# EasyEDA Pro project ProProject_STM32F103ZET6_OV7670FIFO_TFT_2024-07-11.epro

# Schematic Schematic1
Create Date: 2024-05-30; Page Name: P1; Project Name: STM32F103ZET6_OV7670FIFO_TFT; Schematic Name: Schematic1; Update Date: 2024-06-04; Company: 嘉立创EDA; Page Size: A4; Version: V1.0
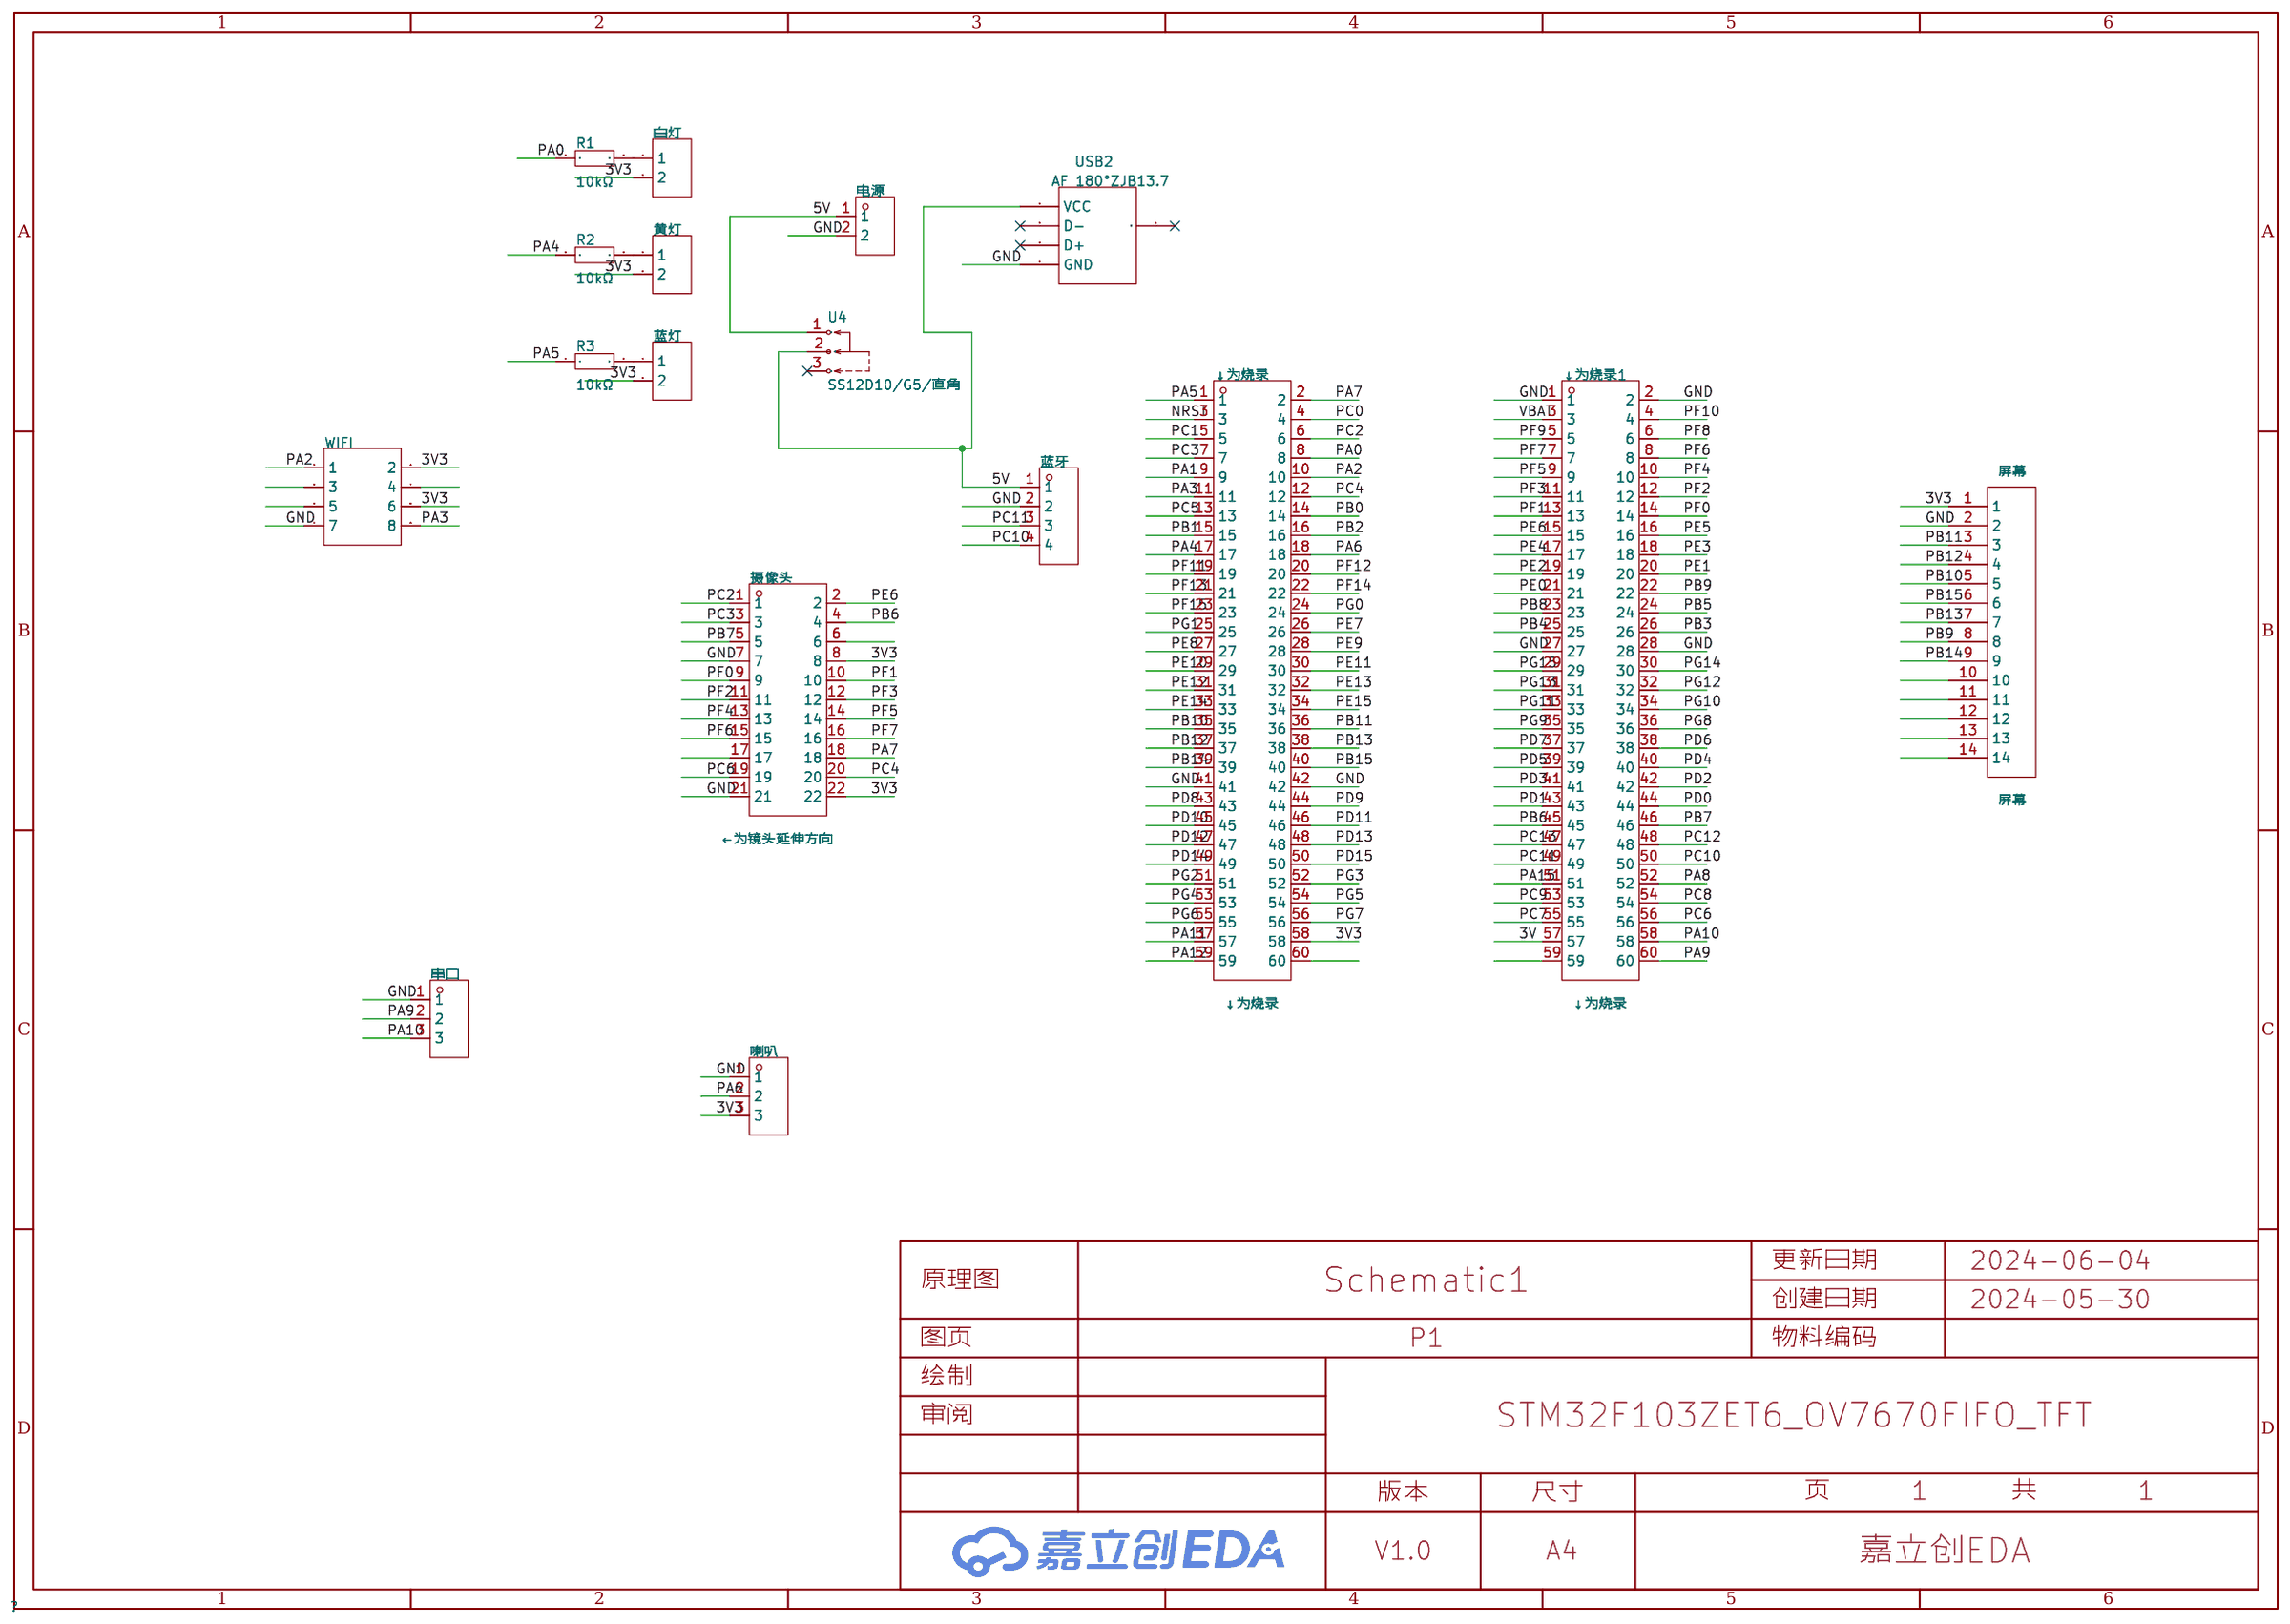
[diagram p0: schematic sheet]

## Parts
R1  10kΩ  [Res_1/8W]
R2  10kΩ  [Res_1/8W]
R3  10kΩ  [Res_1/8W]
U4  SS12D10/G5/直角  [SW-TH_SHOU-HAN_SS12D10G4]
USB2  AF 180°ZJB13.7  [USB-A-TH_AF-ZJB13.7]
WIFI  -  [HDR-TH_8P-P2.54-V-F-R2-C4-S2.54-1]
↓为烧录  ↓为烧录  [HDR-TH_60P-P2.54-H-M-R2-C30-S2.54-N]
↓为烧录1  ↓为烧录  [HDR-TH_60P-P2.54-H-M-R2-C30-S2.54-N]
串口  -  [HDR-TH_3P-P2.54-V-M]
喇叭  -  [HDR-TH_3P-P2.54-V-F]
屏幕  屏幕  [HDR-TH_14P-P2.54-V-F-1]
摄像头  ←为镜头延伸方向  [HDR-TH_22P-P2.54-H-M-R2-C11-S2.54]
电源  MX126-5.0-GN01-02P-CU-S-A  [CONN-TH_2P-P5.00_MX126-5.0-GN01-02P-CU-S-A]
白灯  -  [HDR-TH_2P-P2.54-V-F]
蓝灯  -  [HDR-TH_2P-P2.54-V-F]
蓝牙  -  [HDR-TH_4P-P2.54-V-F]
黄灯  -  [HDR-TH_2P-P2.54-V-F]

## Library data of the parts
R1-R3 = Res_AXIAL-1/8W: Supplier Footprint: 轴向引线
U4 = SS12D10/G5/直角: Supplier Part: C9900029541; Supplier Footprint: THrough hole; JLCPCB Part Class: 扩展库; Supplier: LCSC
USB2 = AF 180°ZJB13.7: link: https://item.szlcsc.com/458822.html; Supplier: LCSC; Supplier Part: C456015; Manufacturer: SHOU HAN(首韩); JLCPCB Part Class: Extended Part
WIFI = HDR-F_2.54_2x4: Supplier Part: C92271; Supplier Footprint: 插件
↓为烧录 ↓为烧录1 = X6521WR-2x30H-C60D30: 插针结构:2x30P;间距:2.54mm;行距:2.54mm;圆针/方针:方针;安装类型:-;排数:双排;总PIN位数:60P;额定电流:3A;额定电压:250V;配合针长度:6mm;塑高:2.5mm;端接针长度:3mm;触头材质:黄铜;触头镀层:金;工作温度范围:-40℃~+105℃;焊接温度(最大值):260℃;颜色:黑色;; LCSC Part Name: 2x30P 间距:2.54mm 方针; Supplier Part: C2883974; Manufacturer: XKB Connection(中国星坤); Supplier Footprint: 弯插,P=2.54mm; JLCPCB Part Class: 扩展库; Supplier: LCSC; Pin Structure: 2x30P; Pitch: 2.54mm; Row Spacing: 2.54mm; Circluar Pins/Square Pins: 方针; Number of Rows: 双排; Number of Pins: 60P; Current Rating (Max): 3A; Voltage Rating (Max): 250V; Length of Mating Pin: 6mm; Insulation Height: 2.5mm; Length of End Connection Pin: 3mm; Contact Material: 黄铜; Contact Plating: 金; Operating Temperature Range: -40℃~+105℃; Soldering Temperature(Max): 260℃; Color: 黑色
串口 = HDR-M_2.54_1x3P: Supplier Part: C2937625; Supplier Footprint: 插件
喇叭 = HDR-F_2.54_1x3P: Supplier Part: C541850; Supplier Footprint: 插件
屏幕 = HDR-F-2.54_1x14P: Supplier Part: C52711; Supplier Footprint: 插件
摄像头 = X6521WR-2x11H-C60D30: 插针结构:2x11P;间距:2.54mm;行距:2.54mm;圆针/方针:方针;安装类型:-;排数:双排;总PIN位数:22P;额定电流:3A;额定电压:250V;配合针长度:6mm;塑高:2.5mm;端接针长度:3mm;触头材质:黄铜;触头镀层:金;工作温度范围:-40℃~+105℃;焊接温度(最大值):260℃;颜色:黑色;; LCSC Part Name: 2x11P 间距:2.54mm 方针; Supplier Part: C725923; Manufacturer: XKB Connection(中国星坤); Supplier Footprint: 弯插,P=2.54mm; JLCPCB Part Class: 扩展库; Supplier: LCSC; Pin Structure: 2x11P; Pitch: 2.54mm; Row Spacing: 2.54mm; Circluar Pins/Square Pins: 方针; Number of Rows: 双排; Number of Pins: 22P; Current Rating (Max): 3A; Voltage Rating (Max): 250V; Length of Mating Pin: 6mm; Insulation Height: 2.5mm; Length of End Connection Pin: 3mm; Contact Material: 黄铜; Contact Plating: 金; Operating Temperature Range: -40℃~+105℃; Soldering Temperature(Max): 260℃; Color: 黑色
电源 = MX126-5.0-GN01-02P-CU-S-A: link: https://atta.szlcsc.com/upload/public/pdf/source/20221024/69A8295958E0DAFC8E5B6F48112698FA.pdf; Supplier: LCSC; Supplier Part: C5188434; Manufacturer: MAX(迈旭); Manufacturer Part: MX126-5.0-02P-GN01-Cu-S-A; JLCPCB Part Class: Extended Part
白灯 蓝灯 黄灯 = HDR-F_2.54_1x2P: Supplier Part: C49661; Supplier Footprint: 插件
蓝牙 = HDR-F_2.54_1x4P: Supplier Part: C2718488; Supplier Footprint: 插件

## Nets
3V: ↓为烧录1.57
3V3: WIFI.2 WIFI.6 ↓为烧录.58 喇叭.3 屏幕.1 摄像头.8 摄像头.22 白灯.2 蓝灯.2 黄灯.2
5V: U4.1 U4.2 USB2.1(VCC) ↓为烧录.60 ↓为烧录1.59 电源.1 蓝牙.1
GND: USB2.4(GND) WIFI.7 ↓为烧录.41 ↓为烧录.42 ↓为烧录1.1 ↓为烧录1.2 ↓为烧录1.27 ↓为烧录1.28 串口.1 喇叭.1 屏幕.2 摄像头.7 摄像头.21 电源.2 蓝牙.2
VBAT: ↓为烧录1.3
NRST: ↓为烧录.3
PA0: R1.1 ↓为烧录.8
PA1: ↓为烧录.9
PA2: WIFI.1 ↓为烧录.10
PA3: WIFI.8 ↓为烧录.11
PA4: R2.1 ↓为烧录.17
PA5: R3.1 ↓为烧录.1
PA6: ↓为烧录.18 喇叭.2
PA7: ↓为烧录.2 摄像头.18
PA8: ↓为烧录1.52
PA9: ↓为烧录1.60 串口.2
PA10: ↓为烧录1.58 串口.3
PA11: ↓为烧录.57
PA12: ↓为烧录.59
PA15: ↓为烧录1.51
PB0: ↓为烧录.14
PB1: ↓为烧录.15
PB2: ↓为烧录.16
PB3: ↓为烧录1.26
PB4: ↓为烧录1.25
PB5: ↓为烧录1.24
PB6: ↓为烧录1.45 摄像头.4
PB7: ↓为烧录1.46 摄像头.5
PB8: ↓为烧录1.23
PB9: ↓为烧录1.22 屏幕.8
PB10: ↓为烧录.35 屏幕.5
PB11: ↓为烧录.36 屏幕.3
PB12: ↓为烧录.37 屏幕.4
PB13: ↓为烧录.38 屏幕.7
PB14: ↓为烧录.39 屏幕.9
PB15: ↓为烧录.40 屏幕.6
PC0: ↓为烧录.4
PC1: ↓为烧录.5
PC2: ↓为烧录.6 摄像头.1
PC3: ↓为烧录.7 摄像头.3
PC4: ↓为烧录.12 摄像头.20
PC5: ↓为烧录.13
PC6: ↓为烧录1.56 摄像头.19
PC7: ↓为烧录1.55
PC8: ↓为烧录1.54
PC9: ↓为烧录1.53
PC10: ↓为烧录1.50 蓝牙.4
PC11: ↓为烧录1.49 蓝牙.3
PC12: ↓为烧录1.48
PC13: ↓为烧录1.47
PD0: ↓为烧录1.44
PD1: ↓为烧录1.43
PD2: ↓为烧录1.42
PD3: ↓为烧录1.41
PD4: ↓为烧录1.40
PD5: ↓为烧录1.39
PD6: ↓为烧录1.38
PD7: ↓为烧录1.37
PD8: ↓为烧录.43
PD9: ↓为烧录.44
PD10: ↓为烧录.45
PD11: ↓为烧录.46
PD12: ↓为烧录.47
PD13: ↓为烧录.48
PD14: ↓为烧录.49
PD15: ↓为烧录.50
PE0: ↓为烧录1.21
PE1: ↓为烧录1.20
PE2: ↓为烧录1.19
PE3: ↓为烧录1.18
PE4: ↓为烧录1.17
PE5: ↓为烧录1.16
PE6: ↓为烧录1.15 摄像头.2
PE7: ↓为烧录.26
PE8: ↓为烧录.27
PE9: ↓为烧录.28
PE10: ↓为烧录.29
PE11: ↓为烧录.30
PE12: ↓为烧录.31
PE13: ↓为烧录.32
PE14: ↓为烧录.33
PE15: ↓为烧录.34
PF0: ↓为烧录1.14 摄像头.9
PF1: ↓为烧录1.13 摄像头.10
PF2: ↓为烧录1.12 摄像头.11
PF3: ↓为烧录1.11 摄像头.12
PF4: ↓为烧录1.10 摄像头.13
PF5: ↓为烧录1.9 摄像头.14
PF6: ↓为烧录1.8 摄像头.15
PF7: ↓为烧录1.7 摄像头.16
PF8: ↓为烧录1.6
PF9: ↓为烧录1.5
PF10: ↓为烧录1.4
PF11: ↓为烧录.19
PF12: ↓为烧录.20
PF13: ↓为烧录.21
PF14: ↓为烧录.22
PF15: ↓为烧录.23
PG0: ↓为烧录.24
PG1: ↓为烧录.25
PG2: ↓为烧录.51
PG3: ↓为烧录.52
PG4: ↓为烧录.53
PG5: ↓为烧录.54
PG6: ↓为烧录.55
PG7: ↓为烧录.56
PG8: ↓为烧录1.36
PG9: ↓为烧录1.35
PG10: ↓为烧录1.34
PG11: ↓为烧录1.33
PG12: ↓为烧录1.32
PG13: ↓为烧录1.31
PG14: ↓为烧录1.30
PG15: ↓为烧录1.29
$1N3460: R1.2 白灯.1
$1N3486: R2.2 黄灯.1
$1N3512: R3.2 蓝灯.1

Not connected (* = marked no-connect by the designer): U4 3*; USB2 2(D-)* 3(D+)* 5(SHLD)*; WIFI 3 4 5; 屏幕 10 11 12 13 14; 摄像头 6 17

# Board PCB1
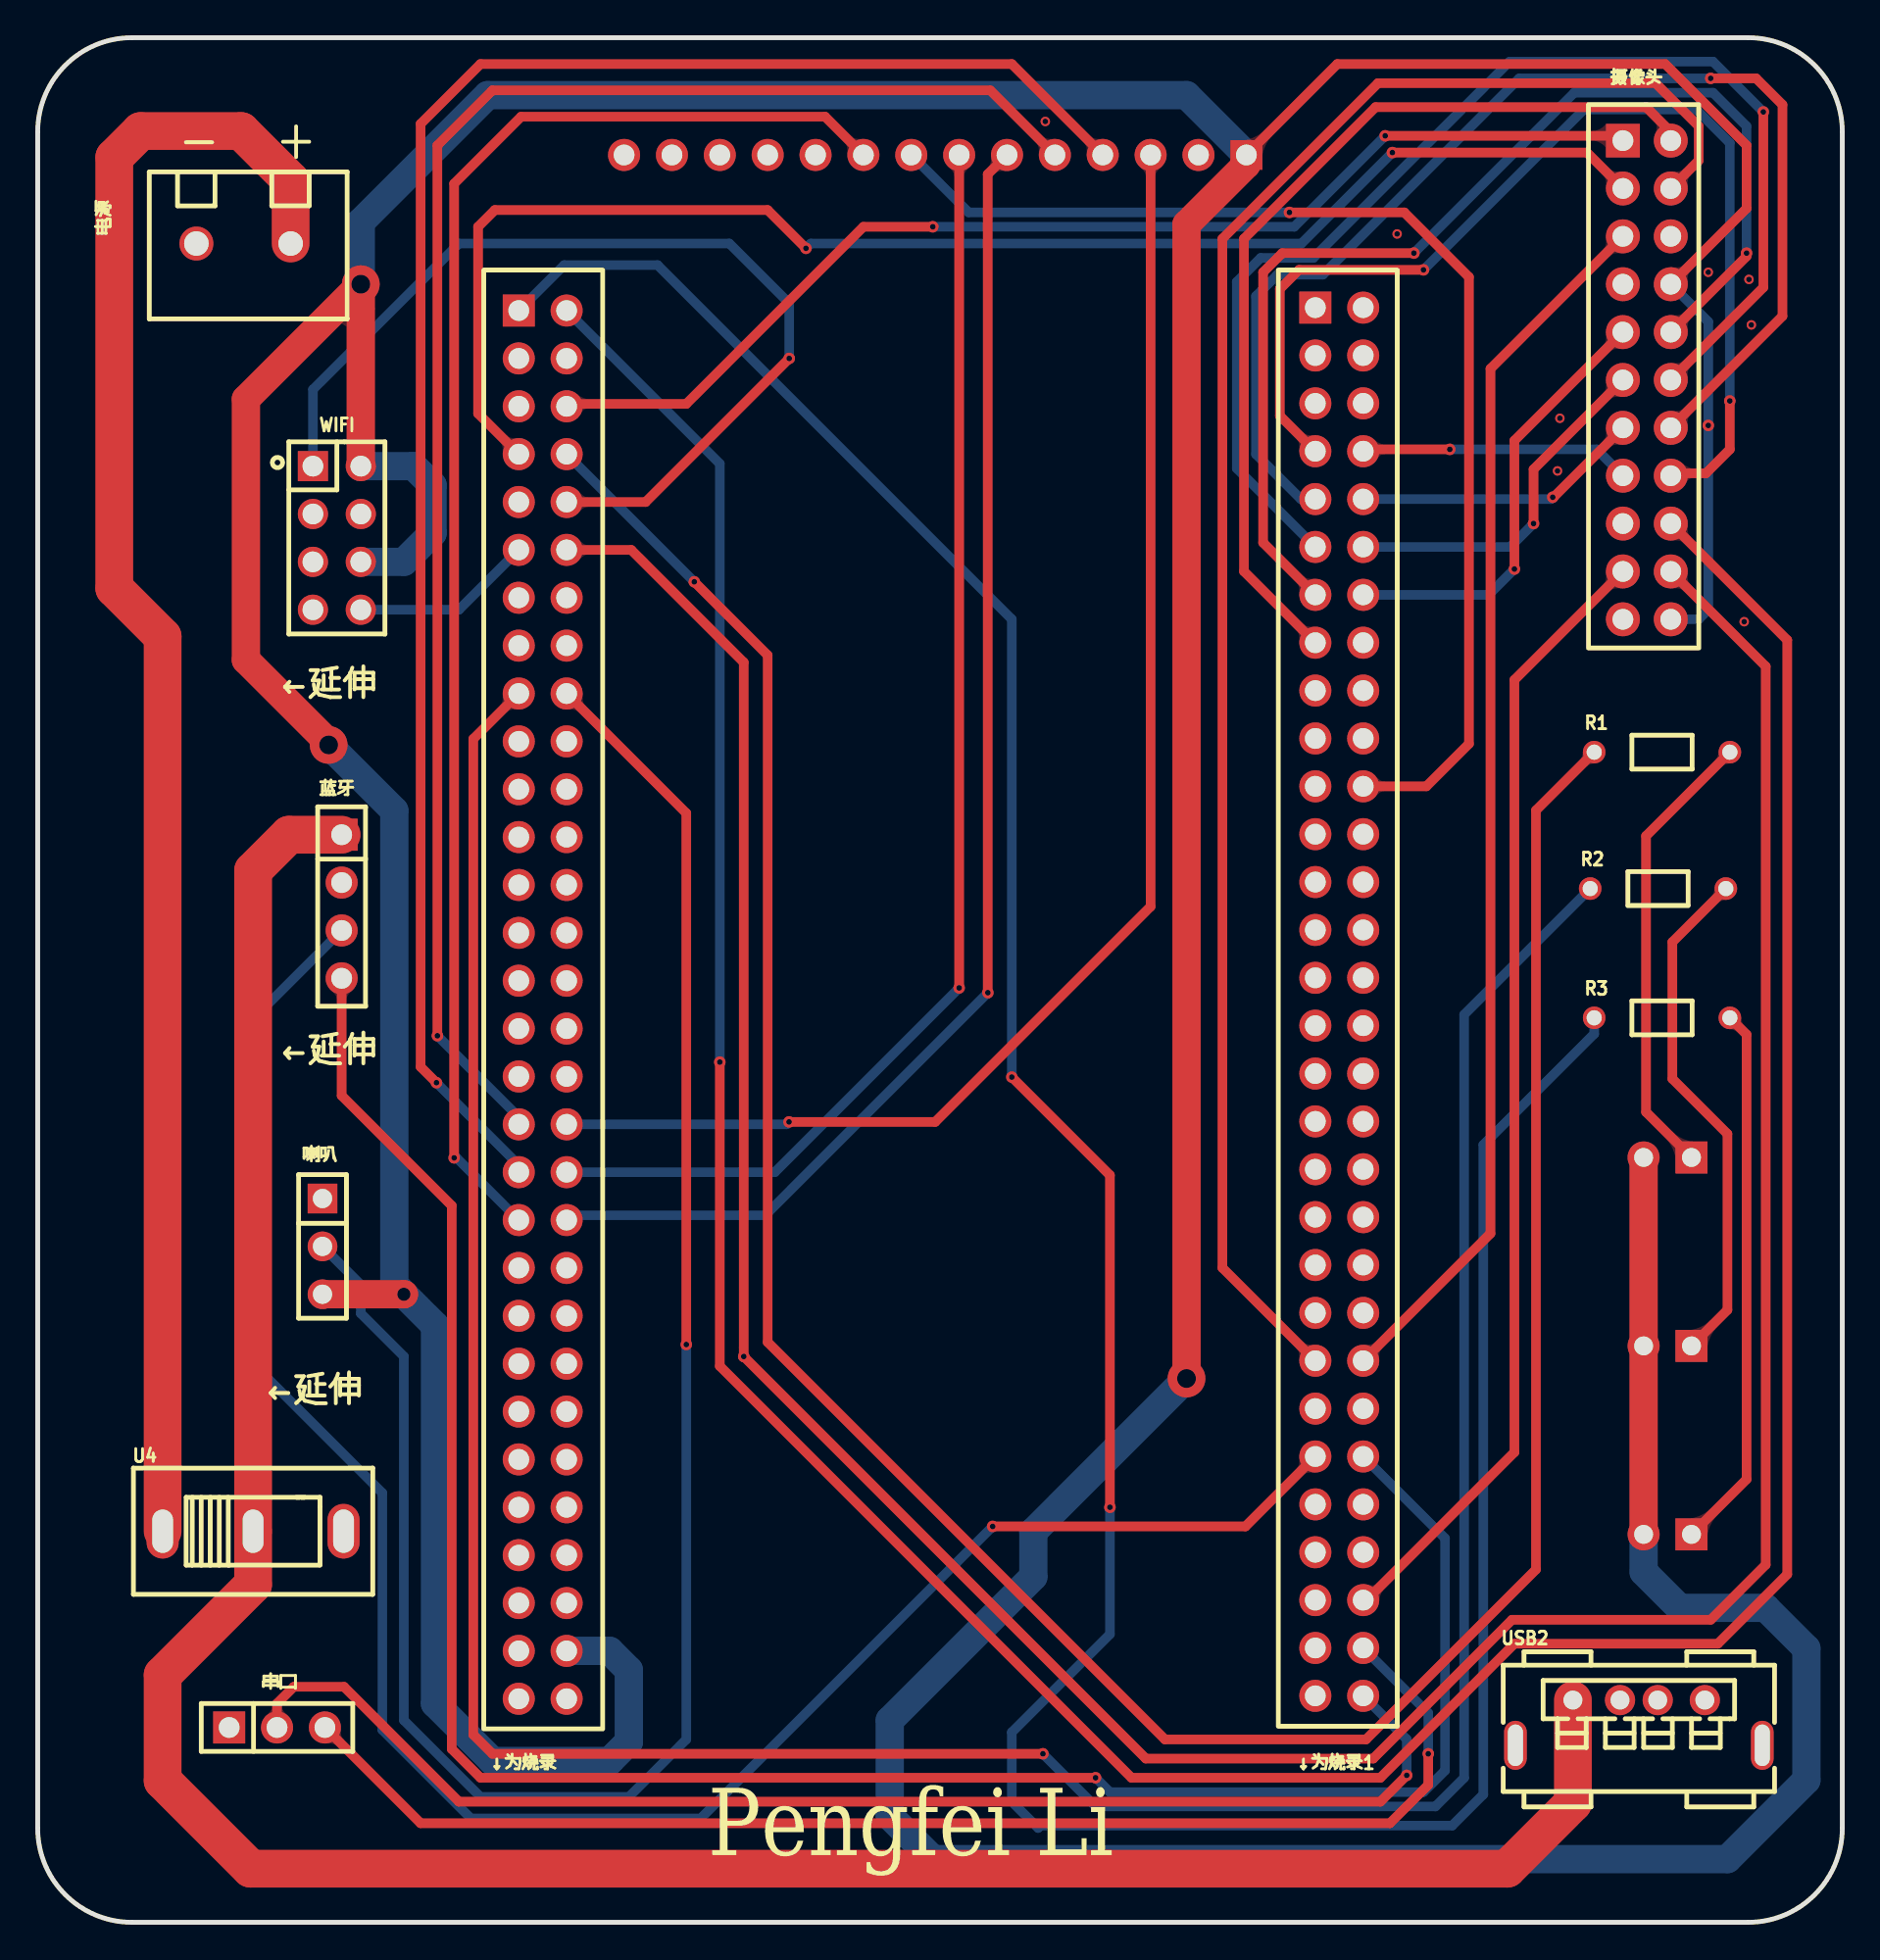
[diagram p1: board, top side]
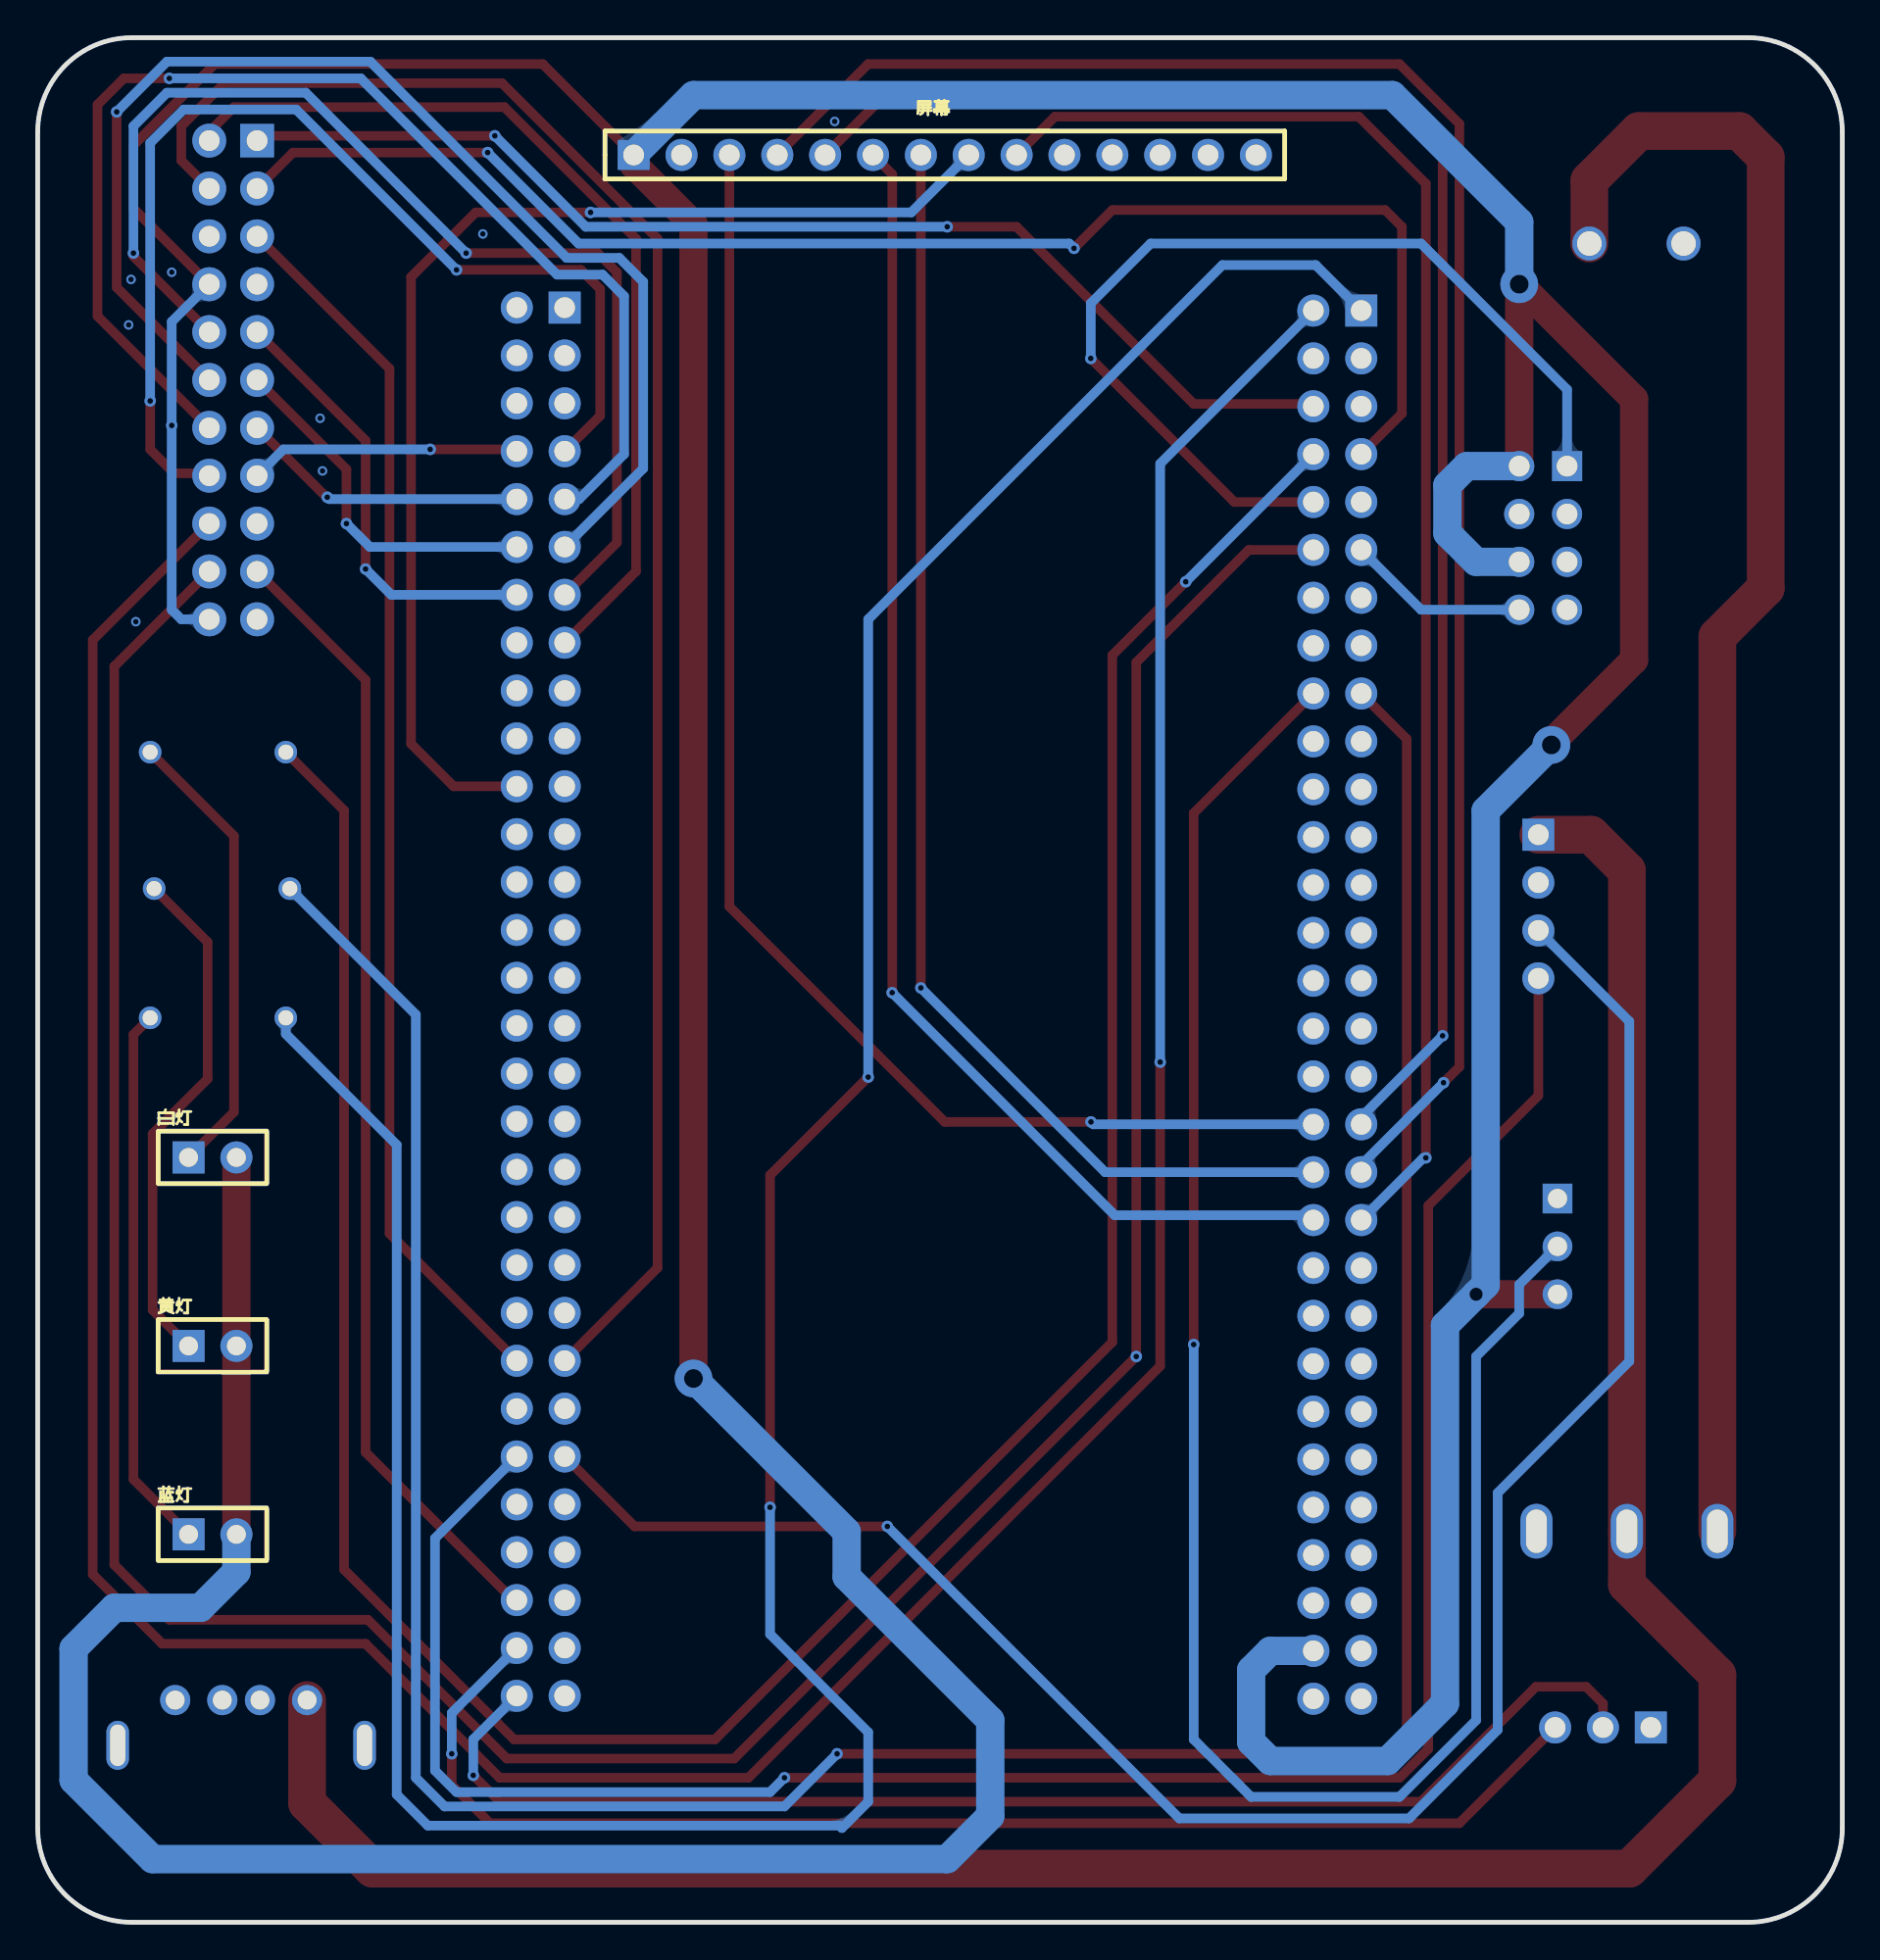
[diagram p2: board, bottom side, seen from below]

Outline 95.76 x 100 mm; copper layers: Top Layer, Bottom Layer. Coordinates in mm from the lower left corner of the outline.
Outline path: 0,95 0,5 arc(1.46,1.46) 5,0 90.76,0 arc(94.29,1.46) 95.76,5 95.76,95 arc(94.29,98.54) 90.76,100 5,100 arc(1.46,98.54) 0,95
Stack: Top Layer 0.035mm / Dielectric1 1.51mm FR4 er 4.5 / Bottom Layer 0.035mm

## Design rules (mm)
template: 自定义配置
spacing copperThickness1oz (default): track to track 0.102, other pairs 0.152 to 0.3
spacing copperThickness2oz: track to track 0.203, other pairs 0.152 to 0.3
track width copperThickness1oz (default): min 0.381, default 0.381, max 2.54
track width copperThickness2oz: min 0.203, default 0.254, max 2.54
differential pair differentialPair (default): width min 0.127, default 0.254, max 2.54; gap min 0.152, default 0.152
via viaSize (default): diameter min 0.5, default 0.61, max 10; hole min 0.3, default 0.305, max 6.299

## Placement (name value [footprint] x y rotation side)
R1  10kΩ  [Res_1/8W]  86.19 62.03 0 top
R2  10kΩ  [Res_1/8W]  85.98 54.79 0 top
R3  10kΩ  [Res_1/8W]  86.19 47.93 0 top
U4  SS12D10/G5/直角  [SW-TH_SHOU-HAN_SS12D10G4]  11.43 20.75 0 top
USB2  AF 180°ZJB13.7  [USB-A-TH_AF-ZJB13.7]  84.96 10.59 0 top
WIFI  -  [HDR-TH_8P-P2.54-V-F-R2-C4-S2.54-1]  15.88 73.46 270 top
↓为烧录  ↓为烧录  [HDR-TH_60P-P2.54-H-M-R2-C30-S2.54-N]  26.8 48.69 270 top
↓为烧录1  ↓为烧录  [HDR-TH_60P-P2.54-H-M-R2-C30-S2.54-N]  69.06 48.85 270 top
串口  -  [HDR-TH_3P-P2.54-V-M]  12.7 10.34 0 top
喇叭  -  [HDR-TH_3P-P2.54-V-F]  15.11 35.87 270 top
屏幕  屏幕  [HDR-TH_14P-P2.54-V-F-1]  47.62 93.78 180 bottom
摄像头  ←为镜头延伸方向  [HDR-TH_22P-P2.54-H-M-R2-C11-S2.54]  85.39 81.84 270 top
电源  MX126-5.0-GN01-02P-CU-S-A  [CONN-TH_2P-P5.00_MX126-5.0-GN01-02P-CU-S-A]  10.92 89.08 180 top
白灯  -  [HDR-TH_2P-P2.54-V-F]  86.48 40.58 180 bottom
蓝灯  -  [HDR-TH_2P-P2.54-V-F]  86.48 20.58 180 bottom
蓝牙  -  [HDR-TH_4P-P2.54-V-F]  16.13 53.9 270 top
黄灯  -  [HDR-TH_2P-P2.54-V-F]  86.48 30.58 180 bottom

## Footprints (pads in the part's own frame, mm; a bottom-side part is the same pattern mirrored in y, then rotated)
CONN-TH_2P-P5.00_MX126-5.0-GN01-02P-CU-S-A
  round 1.8 hole 1.3: 1(-2.5,0) 2(2.5,0)
HDR-TH_2P-P2.54-V-F
  rect 1.7x1.7 hole 1: 1(-1.27,0)
  round 1.7 hole 1: 2(1.27,0)
HDR-TH_3P-P2.54-V-F
  rect 1.575x1.575 hole 1.02: 1(-2.54,0)
  round 1.575 hole 1.02: 2(0,0) 3(2.54,0)
HDR-TH_3P-P2.54-V-M
  rect 1.7x1.7 hole 1.1: 1(-2.54,0)
  round 1.7 hole 1.1: 2(0,0) 3(2.54,0)
HDR-TH_4P-P2.54-V-F
  rect 1.7x1.7 hole 1.1: 1(-3.81,0)
  round 1.7 hole 1.1: 2(-1.27,0) 3(1.27,0) 4(3.81,0)
HDR-TH_8P-P2.54-V-F-R2-C4-S2.54-1
  rect 1.6x1.6 hole 1.1: 1(-3.81,-1.27)
  round 1.6 hole 1.1: 2(-3.81,1.27) 3(-1.27,-1.27) 4(-1.27,1.27) 5(1.27,-1.27) 6(1.27,1.27) 7(3.81,-1.27) 8(3.81,1.27)
HDR-TH_14P-P2.54-V-F-1
  rect 1.7x1.575 hole 1.1: 1(-16.51,0)
  round 1.7 hole 1.1: 2(-13.97,0) 3(-11.43,0) 4(-8.89,0) 5(-6.35,0) 6(-3.81,0) 7(-1.27,0) 8(1.27,0) 9(3.81,0) 10(6.35,0) 11(8.89,0) 12(11.43,0) 13(13.97,0) 14(16.51,0)
HDR-TH_22P-P2.54-H-M-R2-C11-S2.54
  rect 1.778x1.8 hole 1.1: 1(-12.7,-1.27)
  round 1.8 hole 1.1: 2(-12.7,1.27) 3(-10.16,-1.27) 4(-10.16,1.27) 5(-7.62,-1.27) 6(-7.62,1.27) 7(-5.08,-1.27) 8(-5.08,1.27) 9(-2.54,-1.27) 10(-2.54,1.27) 11(0,-1.27) 12(0,1.27) 13(2.54,-1.27) 14(2.54,1.27) 15(5.08,-1.27) 16(5.08,1.27) 17(7.62,-1.27) 18(7.62,1.27) 19(10.16,-1.27) 20(10.16,1.27) 21(12.7,-1.27) 22(12.7,1.27)
HDR-TH_60P-P2.54-H-M-R2-C30-S2.54-N
  rect 1.7x1.7 hole 1.1: 1(-36.83,-1.27)
  round 1.7 hole 1.1: 2(-36.83,1.27) 3(-34.29,-1.27) 4(-34.29,1.27) 5(-31.75,-1.27) 6(-31.75,1.27) 7(-29.21,-1.27) 8(-29.21,1.27) 9(-26.67,-1.27) 10(-26.67,1.27) 11(-24.13,-1.27) 12(-24.13,1.27) 13(-21.59,-1.27) 14(-21.59,1.27) 15(-19.05,-1.27) 16(-19.05,1.27) 17(-16.51,-1.27) 18(-16.51,1.27) 19(-13.97,-1.27) 20(-13.97,1.27) 21(-11.43,-1.27) 22(-11.43,1.27) 23(-8.89,-1.27) 24(-8.89,1.27) 25(-6.35,-1.27) 26(-6.35,1.27) 27(-3.81,-1.27) 28(-3.81,1.27) 29(-1.27,-1.27) 30(-1.27,1.27) 31(1.27,-1.27) 32(1.27,1.27) 33(3.81,-1.27) 34(3.81,1.27) 35(6.35,-1.27) 36(6.35,1.27) 37(8.89,-1.27) 38(8.89,1.27) 39(11.43,-1.27) 40(11.43,1.27) 41(13.97,-1.27) 42(13.97,1.27) 43(16.51,-1.27) 44(16.51,1.27) 45(19.05,-1.27) 46(19.05,1.27) 47(21.59,-1.27) 48(21.59,1.27) 49(24.13,-1.27) 50(24.13,1.27) 51(26.67,-1.27) 52(26.67,1.27) 53(29.21,-1.27) 54(29.21,1.27) 55(31.75,-1.27) 56(31.75,1.27) 57(34.29,-1.27) 58(34.29,1.27) 59(36.83,-1.27) 60(36.83,1.27)
Res_1/8W
  round 1.199 hole 0.8: 1(-3.599,0.063) 2(3.599,0.063)
SW-TH_SHOU-HAN_SS12D10G4
  oval 1.7x2.9 hole 1.1x2.3: 1(-4.8,0) 2(0,0) 3(4.8,0)
USB-A-TH_AF-ZJB13.7
  round 1.6 hole 1: 1(-3.5,1.2) 2(-1,1.2) 3(1,1.2) 4(3.5,1.2)
  oval 1.2x2.6 hole 0.8x2.2: 5(6.55,-1.2) 6(-6.55,-1.2)

## Nets
As in the schematic, except:
5V: U4.1 U4.2 USB2.1 电源.1 蓝牙.1

Pads without a net: U4 3; USB2 2 3 5 6; ↓为烧录 60; ↓为烧录1 59

## Via types
v1: diameter 0.61, hole 0.305, Top Layer to Bottom Layer, 34 vias
v2: diameter 0.5, hole 0.299, Top Layer to Bottom Layer, 8 vias
v3: diameter 2, hole 1, Top Layer to Bottom Layer, 3 vias
v4: diameter 1.5, hole 0.7, Top Layer to Bottom Layer, 1 via

## Routing (per net, layer and track width the routed paths; a pad name or vN(x,y) marks a point on that pad's centre or on a via; arc(x,y) is an arc through that point)
3V3: length 429.1
  Top Layer w0.508: v3(60.96,28.85) 61.21,29.11 61.21,30.28 ; 屏幕.1 68.96,98.6 86.36,98.6 90.68,94.28 90.68,90.94 摄像头.8
  Top Layer w1.5: 白灯.2 黄灯.2 蓝灯.2 ; 屏幕.1 64.13,93.27 60.96,90.09 v3(60.96,28.85) 60.96,28.63 ; v4(19.43,33.33) 喇叭.3 ; WIFI.2 v3(17.14,86.92) 11.05,80.82 11.05,66.98 15.44,62.59 v3(15.44,62.47)
  Bottom Layer w0.508: 摄像头.8 88.65,84.93 v1(88.65,79.43) 88.65,69.65 88.14,69.14 摄像头.22
  Bottom Layer w1.5: 屏幕.1 60.96,96.95 23.88,96.95 17.14,90.22 v3(17.14,86.92) ; v3(15.44,62.47) 18.92,58.99 18.92,33.83 v4(19.43,33.33) 21.08,31.67 21.08,11.61 24.13,8.56 30.35,8.56 31.37,9.58 31.37,13.39 30.35,14.4 ↓为烧录.58 ; v3(60.96,28.85) 52.83,20.73 52.83,18.34 45.21,10.72 45.21,5.64 47.5,3.35 89.66,3.35 93.85,7.54 93.85,14.53 91.69,16.69 87.12,16.69 85.21,18.6 蓝灯.2 ; WIFI.2 19.94,77.27 20.95,76.25 20.95,73.71 19.43,72.19 17.14,72.19
5V: length 227.8
  Top Layer w2: USB2.1 81.46,6.33 77.98,2.84 11.3,2.84 6.63,7.52 6.63,13.12 11.43,17.92 U4.2 11.43,55.8 13.33,57.71 蓝牙.1 ; U4.1 6.63,68.22 4.06,70.79 4.06,93.65 5.46,95.05 10.8,95.05 13.42,92.42 电源.1
GND:
  vias: v2(53.47,95.56) v2(72.14,89.59) v2(80.65,77.01) v2(80.77,79.81) v2(88.65,87.55) v2(90.55,69.01) v2(90.81,87.17) v2(90.93,84.76)
PA0: length 149.4
  Top Layer w0.508: v1(34.84,71.13) 38.73,67.23 38.73,30.78 59.82,9.7 70.48,9.7 79.5,18.72 79.5,59 R1.1
  Bottom Layer w0.508: v1(34.84,71.13) ↓为烧录.8
PA2: length 51.7
  Top Layer w0.508: v1(39.88,82.98) 32.26,75.36 ↓为烧录.10
  Bottom Layer w0.508: v1(39.88,82.98) 39.88,85.9 36.7,89.08 22.35,89.08 14.61,81.33 WIFI.1
PA3: length 9.7
  Bottom Layer w0.508: ↓为烧录.11 22.35,69.65 WIFI.8
PA4: length 161
  Top Layer w0.508: v1(53.34,8.94) 24.13,8.94 23.11,9.96 23.11,62.79 ↓为烧录.17
  Bottom Layer w0.508: v1(53.34,8.94) 56.13,6.15 74.17,6.15 75.69,7.67 75.69,48.16 R2.1
PA5: length 172
  Top Layer w0.508: v1(56.9,22.02) 56.9,39.64 v1(51.69,44.85)
  Bottom Layer w0.508: v1(51.69,44.85) 51.69,69.14 32.89,87.94 27.94,87.94 ↓为烧录.1 ; v1(56.9,22.02) 56.9,15.29 51.69,10.08 51.69,6.4 53.09,5 53.21,5.13 75.06,5.13 76.71,6.78 76.71,41.26 82.59,47.14 R3.1
PA6: length 103
  Top Layer w0.508: v1(34.42,30.66) 34.42,58.85 ↓为烧录.18
  Bottom Layer w0.508: 喇叭.2 17.14,33.83 17.14,32.31 19.43,30.02 19.43,10.72 23.5,6.66 31.37,6.66 34.42,9.7 v1(34.42,30.66)
PA7: length 187.8
  Top Layer w0.508: 摄像头.18 92.84,68.04 92.84,18.47 89.15,14.78 78.36,14.78 71.25,7.67 58.04,7.67 36.19,29.52 v1(36.19,45.64)
  Bottom Layer w0.508: ↓为烧录.2 36.19,77.39 v1(36.19,45.64)
PA9: length 69.9
  Top Layer w0.508: 串口.2 12.7,11.61 13.59,12.5 16.26,12.5 22.35,6.4 71.25,6.4 v1(72.64,7.8)
  Bottom Layer w0.508: v1(72.64,7.8) 72.64,9.71 ↓为烧录1.60
PA10: length 70.2
  Top Layer w0.508: v1(73.79,8.94) 73.79,7.29 71.75,5.26 20.32,5.26 串口.3
  Bottom Layer w0.508: v1(73.79,8.94) 73.79,11.1 ↓为烧录1.58
PB6: length 95.1
  Top Layer w0.508: ↓为烧录1.45 62.87,34.73 62.87,89.33 71.12,97.59 85.85,97.59 88.14,95.3 88.14,93.48 摄像头.4
PB7: length 65.4
  Top Layer w0.508: ↓为烧录1.46 77.09,36.55 77.09,82.43 摄像头.5
PB9: length 63.6
  Top Layer w0.508: ↓为烧录1.22 73.69,60.28 75.95,62.53 75.95,87.3 72.52,90.73 v1(66.42,90.73)
  Bottom Layer w0.508: v1(66.42,90.73) 49.4,90.73 屏幕.8
PB10: length 89.1
  Top Layer w0.508: 屏幕.5 50.55,97.21 24.13,97.21 21.21,94.28 v1(21.21,47.04)
  Bottom Layer w0.508: v1(21.21,47.04) 25.53,42.72 ↓为烧录.35
PB11: length 75.7
  Top Layer w0.508: 屏幕.3 59.06,53.9 47.62,42.47 v1(39.87,42.47)
  Bottom Layer w0.508: ↓为烧录.36 39.74,42.34 v1(39.87,42.47)
PB12: length 97.3
  Top Layer w0.508: 屏幕.4 51.69,98.6 23.5,98.6 20.32,95.43 20.32,45.39 v1(21.16,44.55)
  Bottom Layer w0.508: v1(21.16,44.55) 25.53,40.18 ↓为烧录.37
PB13: length 69.1
  Top Layer w0.508: 屏幕.7 v1(48.9,49.58)
  Bottom Layer w0.508: ↓为烧录.38 39.12,39.8 v1(48.9,49.58)
PB14: length 80.5
  Top Layer w0.508: 屏幕.9 41.78,95.81 25.65,95.81 22.1,92.25 v1(22.1,40.56)
  Bottom Layer w0.508: ↓为烧录.39 22.22,40.56 v1(22.1,40.56)
PB15: length 72.2
  Top Layer w0.508: 屏幕.6 50.41,92.75 50.41,49.33 v1(50.42,49.33)
  Bottom Layer w0.508: v1(50.42,49.33) 38.61,37.52 28.32,37.52 ↓为烧录.40
PC2: length 62.1
  Top Layer w0.508: v1(47.5,89.97) 43.81,89.97 34.42,80.57 28.19,80.57 ↓为烧录.6 ; 摄像头.1 83.86,94.79 v1(71.5,94.79)
  Bottom Layer w0.508: v1(71.5,94.79) 66.68,89.97 v1(47.5,89.97)
PC3: length 77.8
  Top Layer w0.508: v1(71.88,93.9) 82.21,93.9 摄像头.3 ; ↓为烧录.7 23.37,80.06 23.37,89.97 24.26,90.86 38.73,90.86 v1(40.77,88.82)
  Bottom Layer w0.508: v1(71.88,93.9) 67.06,89.08 41.02,89.08 v1(40.77,88.82)
PC4: length 170.8
  Top Layer w0.508: 摄像头.20 91.69,66.64 91.69,18.97 88.77,16.05 78.23,16.05 70.87,8.69 58.8,8.69 v1(37.47,30.02) 37.47,66.85 31.5,72.82 ↓为烧录.12
PC6: length 60.4
  Top Layer w0.508: 摄像头.19 78.36,65.92 78.36,24.94 70.51,17.1 ↓为烧录1.56
PC10: length 115.9
  Top Layer w0.508: 蓝牙.4 16.13,43.87 21.97,38.02 21.97,9.19 23.5,7.67 v1(56.13,7.67)
  Bottom Layer w0.508: v1(56.13,7.67) 56.9,6.91 73.53,6.91 74.68,8.05 74.68,20.38 ↓为烧录1.50
PC11: length 106.7
  Top Layer w0.508: ↓为烧录1.49 64.08,21.01 v1(50.67,21.01)
  Bottom Layer w0.508: 蓝牙.3 11.3,47.8 11.3,29.77 18.29,22.78 18.29,10.21 22.99,5.51 35.18,5.51 v1(50.67,21.01)
PE6: length 49.6
  Top Layer w0.508: ↓为烧录1.15 64.01,71.68 64.01,89.33 70.99,96.32 85.34,96.32 86.66,95.01 摄像头.2
PF0: length 23.5
  Top Layer w0.508: 摄像头.9 78.36,78.62 v1(78.36,71.81)
  Bottom Layer w0.508: ↓为烧录1.14 76.99,70.44 v1(78.36,71.81)
PF1: length 61.2
  Top Layer w0.508: ↓为烧录1.13 65.02,73.21 65.02,87.55 66.04,88.57 v1(73.03,88.57) ; 摄像头.10 90.68,88.4 v1(90.68,88.57)
  Bottom Layer w0.508: v1(90.68,88.57) 90.68,95.3 88.9,97.08 81.53,97.08 v1(73.03,88.57)
PF2: length 19.1
  Top Layer w0.508: 摄像头.11 79.38,77.1 v1(79.38,74.22)
  Bottom Layer w0.508: v1(79.38,74.22) 78.13,72.98 ↓为烧录1.12
PF3: length 65.9
  Top Layer w0.508: 摄像头.12 91.57,86.75 v1(91.57,96.06)
  Bottom Layer w0.508: v1(91.57,96.06) 88.9,98.73 78.1,98.73 67.69,88.32 64.9,88.32 63.63,87.05 63.63,77.15 ↓为烧录1.11
PF4: length 15.3
  Top Layer w0.508: 摄像头.13 80.43,75.62 v1(80.39,75.62)
  Bottom Layer w0.508: ↓为烧录1.10 80.29,75.52 v1(80.39,75.62)
PF5: length 65.4
  Top Layer w0.508: v1(88.77,97.84) 91.19,97.84 92.58,96.44 92.58,85.23 摄像头.14
  Bottom Layer w0.508: v1(88.77,97.84) 78.61,97.84 68.2,87.43 65.79,87.43 64.64,86.28 64.64,77.9 67.03,75.52 ↓为烧录1.9
PF6: length 14.4
  Top Layer w0.508: ↓为烧录1.8 70.43,78.16 v1(74.93,78.16)
  Bottom Layer w0.508: 摄像头.15 82.72,78.16 v1(74.93,78.16)
PF7: length 57.9
  Top Layer w0.508: ↓为烧录1.7 65.91,79.94 65.91,86.67 66.93,87.68 v1(73.53,87.68) ; 摄像头.16 86.78,76.89 88.52,76.89 89.79,78.16 v1(89.79,80.73)
  Bottom Layer w0.508: v1(89.79,80.73) 89.79,94.41 88.01,96.19 82.04,96.19 v1(73.53,87.68)
$1N3460: length 24.3
  Top Layer w0.508: 89.79,62.09 85.34,57.64 85.34,42.99 白灯.1
$1N3486: length 27.4
  Top Layer w0.508: 黄灯.1 89.66,32.49 89.66,41.83 86.74,44.76 86.74,52.01 R2.2
$1N3512: length 29
  Top Layer w0.508: 蓝灯.1 90.68,23.51 90.68,47.11 89.79,47.99

## Copper pours and planes (outline as drawn; the poured copper is in the pictures)
GND on Top Layer: -4.83,104.57 103.25,104.57 103.25,-7.44 -4.83,-7.44
GND on Bottom Layer: -17.4,124.51 117.6,124.51 117.6,-22.56 -17.4,-22.56

Small or netless copper shapes (teardrops, artwork), in the pictures only: 55 on Top Layer, 34 on Bottom Layer

## Text on the board
Top Silkscreen Layer: - | + | ←延伸 | Pengfei Li
